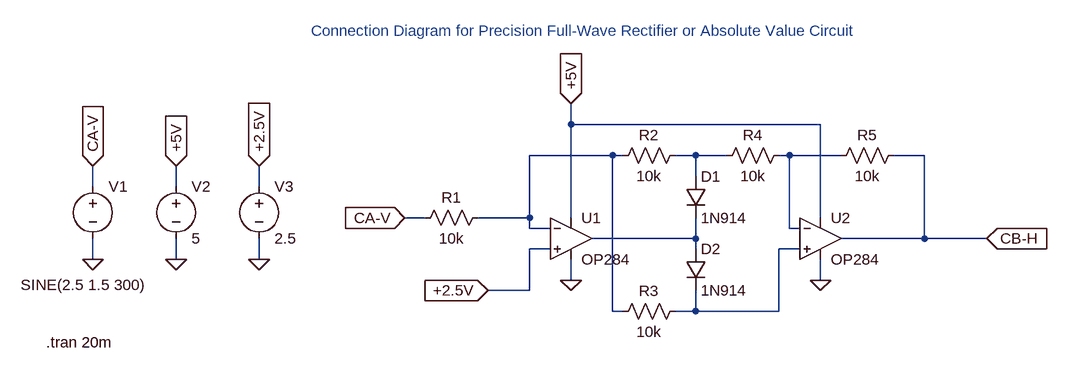
[diagram p0: schematic precision_full_wave_rect_ltspice.asc]
precision_full_wave_rect_ltspice.asc, the LTspice schematic file:
Version 4
SHEET 1 1032 680
WIRE 224 16 224 -16
WIRE 608 16 224 16
WIRE 288 64 160 64
WIRE 304 64 288 64
WIRE 416 64 384 64
WIRE 464 64 416 64
WIRE 560 64 544 64
WIRE 640 64 560 64
WIRE 768 64 720 64
WIRE 416 96 416 64
WIRE -512 112 -512 80
WIRE -384 112 -384 80
WIRE -256 112 -256 80
WIRE 0 160 -32 160
WIRE 160 160 160 64
WIRE 160 160 80 160
WIRE 224 160 224 16
WIRE 608 160 608 16
WIRE 160 176 160 160
WIRE 192 176 160 176
WIRE 560 176 560 64
WIRE 576 176 560 176
WIRE 416 192 416 160
WIRE 416 192 256 192
WIRE 768 192 768 64
WIRE 768 192 640 192
WIRE 864 192 768 192
WIRE 192 208 160 208
WIRE 416 208 416 192
WIRE 576 208 544 208
WIRE -512 224 -512 192
WIRE -384 224 -384 192
WIRE -256 224 -256 192
WIRE 224 256 224 224
WIRE 608 256 608 224
WIRE 160 272 160 208
WIRE 160 272 96 272
WIRE 288 304 288 64
WIRE 304 304 288 304
WIRE 416 304 416 272
WIRE 416 304 384 304
WIRE 544 304 544 208
WIRE 544 304 416 304
FLAG 864 192 CB-H
IOPIN 864 192 In
FLAG -32 160 CA-V
IOPIN -32 160 In
FLAG 224 256 0
FLAG 224 -16 +5V
IOPIN 224 -16 In
FLAG 96 272 +2.5V
IOPIN 96 272 In
FLAG -512 224 0
FLAG -384 224 0
FLAG -256 224 0
FLAG -512 80 CA-V
IOPIN -512 80 In
FLAG -384 80 +5V
IOPIN -384 80 In
FLAG -256 80 +2.5V
IOPIN -256 80 In
FLAG 608 256 0
SYMBOL Opamps\\OP284 224 128 R0
SYMATTR InstName U1
SYMBOL res 96 144 R90
WINDOW 0 0 56 VBottom 2
WINDOW 3 32 56 VTop 2
SYMATTR InstName R1
SYMATTR Value 10k
SYMBOL res 400 48 R90
WINDOW 0 0 56 VBottom 2
WINDOW 3 32 56 VTop 2
SYMATTR InstName R2
SYMATTR Value 10k
SYMBOL diode 400 96 R0
SYMATTR InstName D1
SYMATTR Value 1N914
SYMBOL diode 400 208 R0
SYMATTR InstName D2
SYMATTR Value 1N914
SYMBOL voltage -512 96 R0
WINDOW 3 -111 167 Left 2
WINDOW 123 0 0 Left 0
WINDOW 39 0 0 Left 0
SYMATTR Value SINE(2.5 1.5 300)
SYMATTR InstName V1
SYMBOL voltage -384 96 R0
WINDOW 123 0 0 Left 0
WINDOW 39 0 0 Left 0
SYMATTR InstName V2
SYMATTR Value 5
SYMBOL voltage -256 96 R0
WINDOW 123 0 0 Left 0
WINDOW 39 0 0 Left 0
SYMATTR InstName V3
SYMATTR Value 2.5
SYMBOL res 400 288 R90
WINDOW 0 0 56 VBottom 2
WINDOW 3 32 56 VTop 2
SYMATTR InstName R3
SYMATTR Value 10k
SYMBOL res 560 48 R90
WINDOW 0 0 56 VBottom 2
WINDOW 3 32 56 VTop 2
SYMATTR InstName R4
SYMATTR Value 10k
SYMBOL res 736 48 R90
WINDOW 0 0 56 VBottom 2
WINDOW 3 32 56 VTop 2
SYMATTR InstName R5
SYMATTR Value 10k
SYMBOL Opamps\\OP284 608 128 R0
SYMATTR InstName U2
TEXT -176 -128 Left 2 ;Connection Diagram for Precision Full-Wave Rectifier or Absolute Value Circuit
TEXT -584 352 Left 2 !.tran 20m

The netlist it stands for:
* precision_full_wave_rect_ltspice.asc
XU1 +2.5V N001 +5V 0 N004 OP284  ; pins In+ In- V+ V- OUT
R1 N001 CA-V 10k
R2 N002 N001 10k
D1 N002 N004 1N914
D2 N004 N005 1N914
V1 CA-V 0 SINE(2.5 1.5 300)
V2 +5V 0 5
V3 +2.5V 0 2.5
R3 N005 N001 10k
R4 N003 N002 10k
R5 CB-H N003 10k
XU2 N005 N003 +5V 0 CB-H OP284  ; pins In+ In- V+ V- OUT
.model D D
.lib standard.dio
* Connection Diagram for Precision Full-Wave Rectifier or Absolute Value Circuit
.tran 20m
.lib ADI1.lib
.backanno
.end